# EasyEDA Pro project PAW3-NOMAG_Cheesecake-Blueberry-LSM6DSV_JST2.epro

# Schematic LSM6DSV_NOMAG_Rv_1
Board Name: LSM6DSV_NOMAG_JST2; Create Date: 2026-05-18; Page Name: LSM6; Project Name: NOMAG_Cheesecake-Blueberry-LSM6DSV_JST2; Schematic Name: LSM6DSV_NOMAG_Rv_1; Update Date: 2026-05-18; Company: Designed by SoraKage; Page Size: A4; Version: V2.3
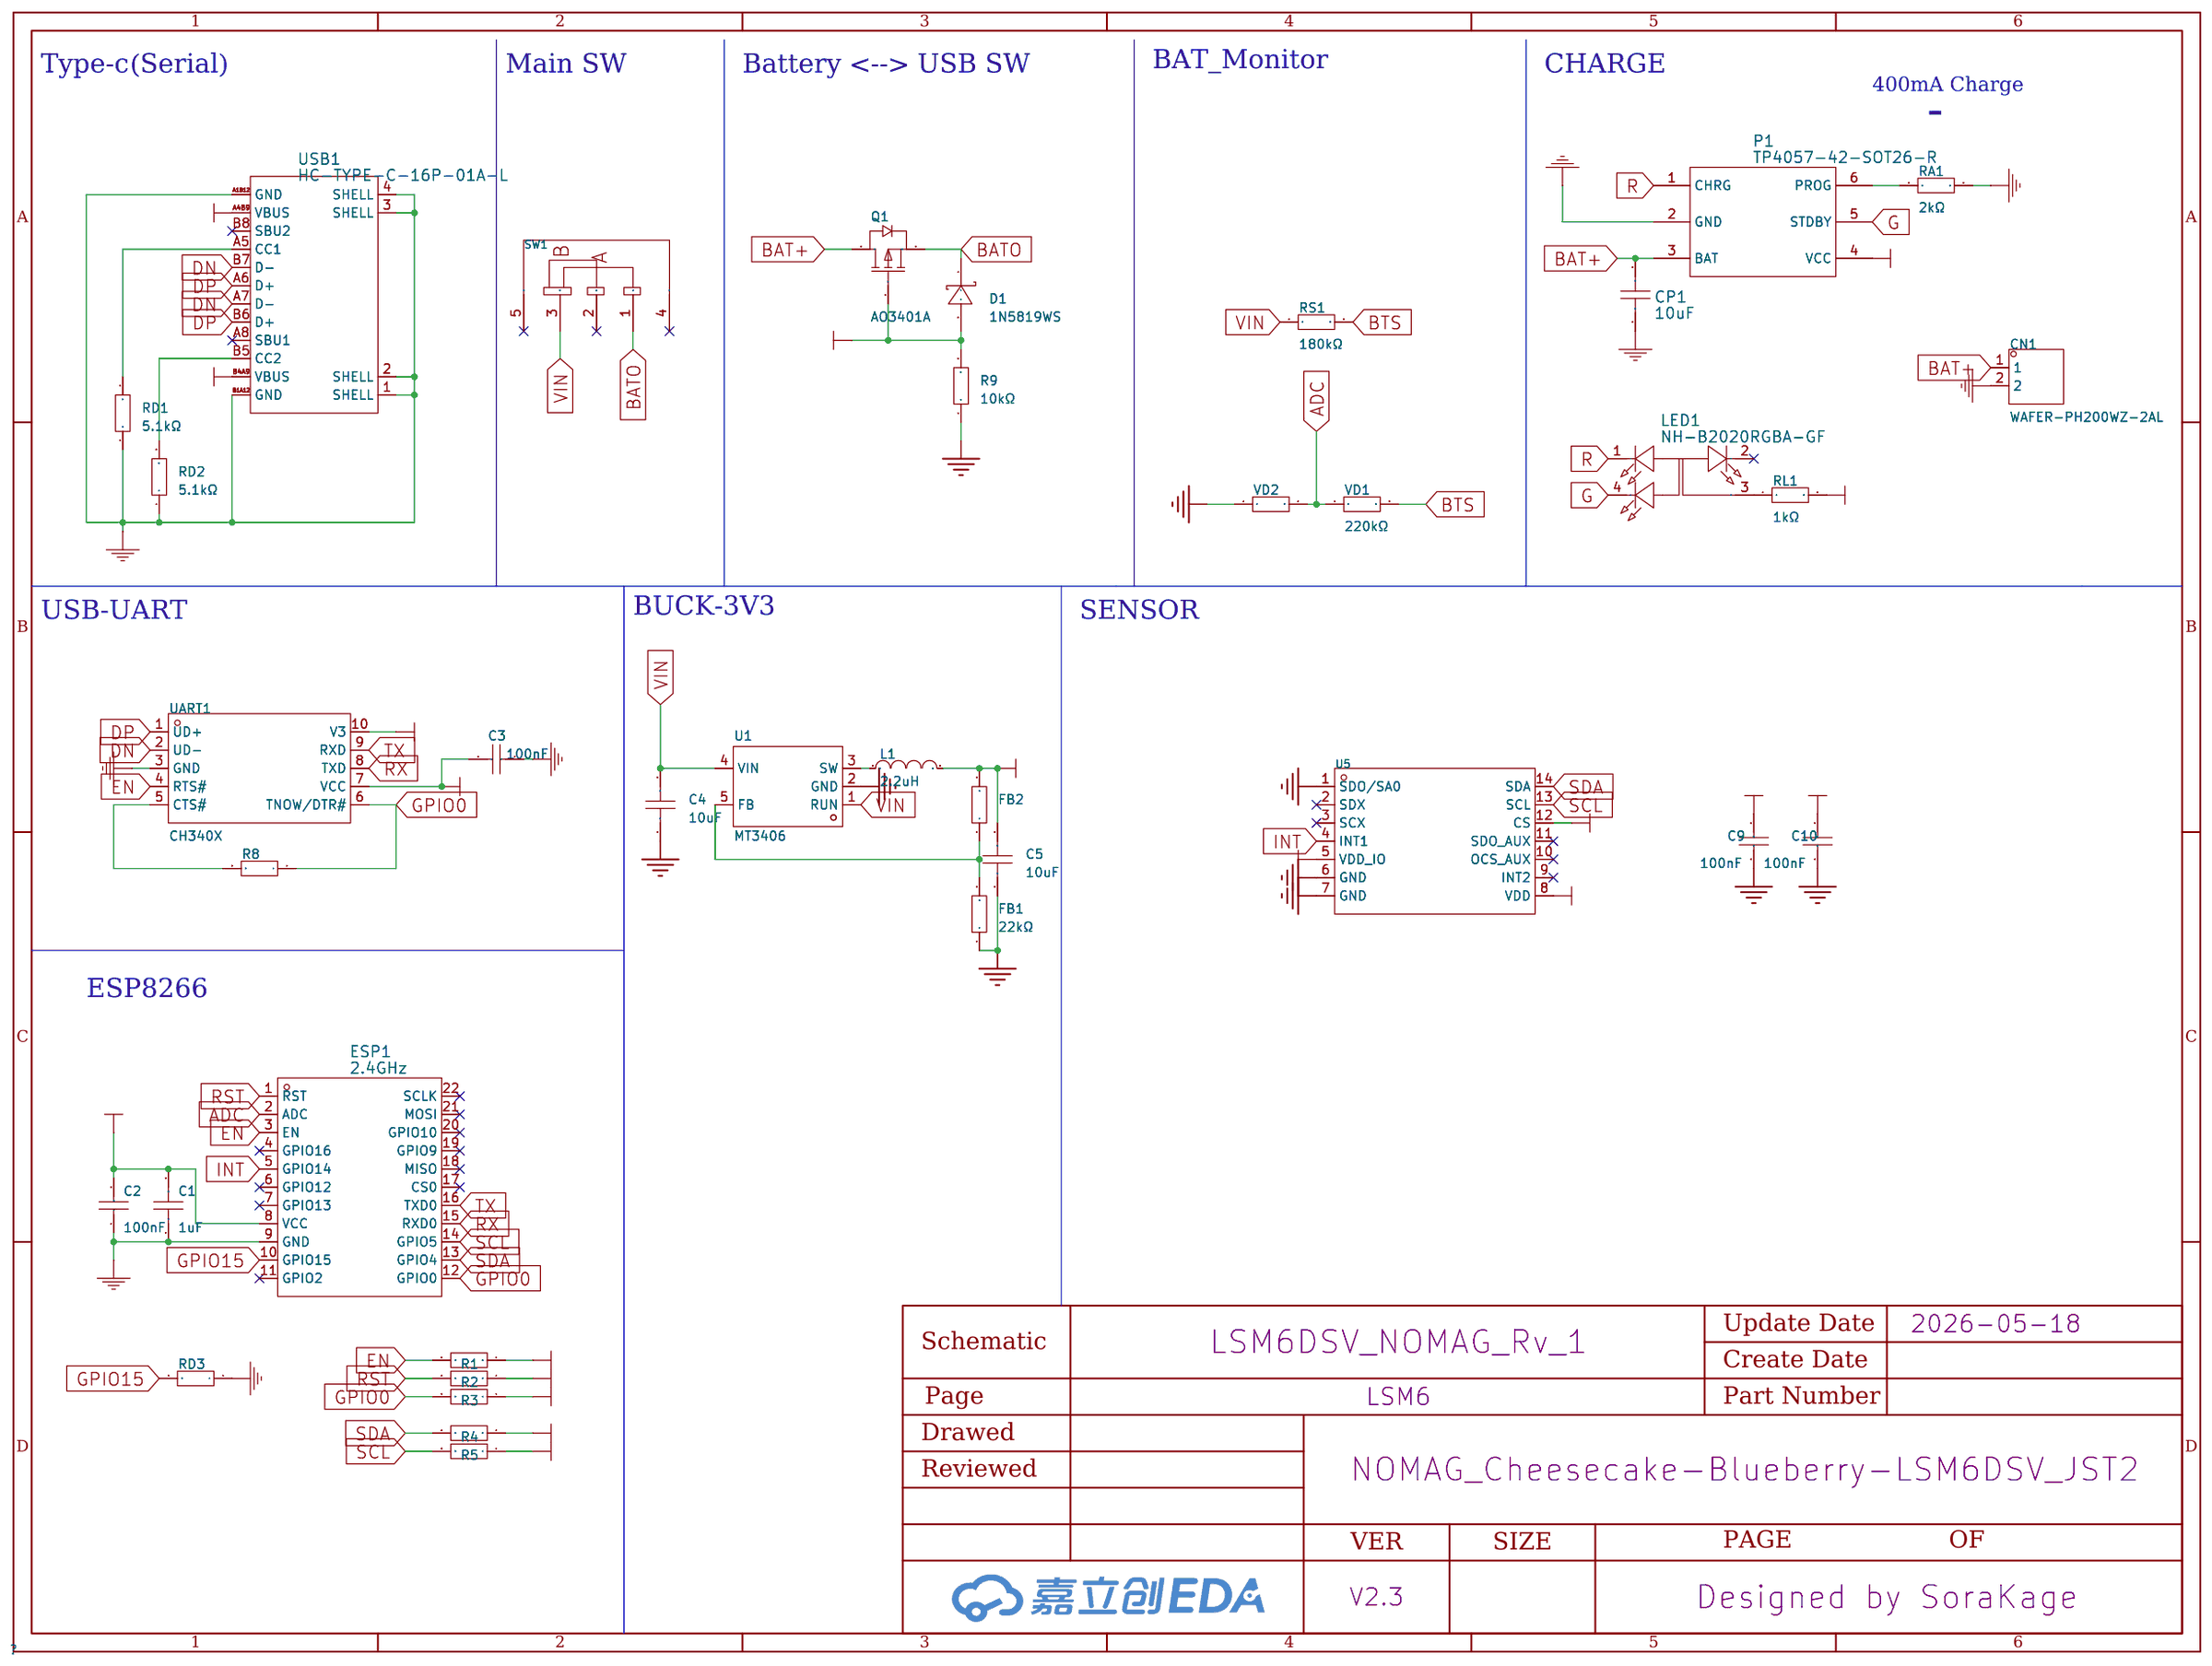
[diagram p0: schematic sheet]

## Parts
C1  1uF  [C0402]
C2  100nF  [C0402]
C3  100nF  [C0402]
C4  10uF  [C0603]
C5  10uF  [C0603]
C9  100nF  [C0402]
C10  100nF  [C0402]
CN1  WAFER-PH200WZ-2AL  [CONN-TH_2P-P2.00_WAFER-PH200WZ-Z102A]
CP1  10uF  [C0603]
D1  1N5819WS  [SOD-323_L1.8-W1.3-LS2.5-RD]
ESP1  2.4GHz  [WIFIM-SMD_ESP-12F-ESP8266MOD]
FB1  22kΩ  [R0402]
FB2  100kΩ  [R0402]
L1  2.2uH  [IND-SMD_L2.5-W2.0_YXMBL252010P]
LED1  NH-B2020RGBA-GF  [LED-ARRAY-SMD_4P-L2.1-W2.1-TL_NH-B2020RGBA]
P1  TP4057-42-SOT26-R  [SOT-23-6_L2.9-W1.6-P0.95-LS2.8-BL]
Q1  AO3401A  [SOT-23_L2.9-W1.3-P1.90-LS2.4-BR]
R1  4.7kΩ  [R0402]
R2  4.7kΩ  [R0402]
R3  4.7kΩ  [R0402]
R4  4.7kΩ  [R0402]
R5  4.7kΩ  [R0402]
R8  4.7kΩ  [R0402]
R9  10kΩ  [R0402]
RA1  2kΩ  [R0402]
RD1  5.1kΩ  [R0402]
RD2  5.1kΩ  [R0402]
RD3  4.7kΩ  [R0402]
RL1  1kΩ  [R0402]
RS1  180kΩ  [R0402]
SW1  K3-1270S-F2  [SW-TH_K3-1270S-F2]
U1  MT3406  [SOT-23-5_L3.0-W1.7-P0.95-LS2.8-BR]
U5  LSM6DSVQTR  [LGA-14_L3.0-W2.5-P0.50-TL]
UART1  CH340X  [MSOP-10_L3.0-W3.0-P0.50-LS5.0-BL]
USB1  HC-TYPE-C-16P-01A-L  [USB-C-SMD_G-SWITCH_GT-USB-7010EN]
VD1  220kΩ  [R0402]
VD2  100kΩ  [R0402]

## Library data of the parts
C1 = CL05A105KA5NQNC: 容值:1uF;精度:±10%;额定电压:25V;材质(温度系数):X5R;; LCSC Part Name: 1uF ±10% 25V; Supplier Part: C52923; Manufacturer: SAMSUNG(三星); Supplier Footprint: 0402; JLCPCB Part Class: 基础库; Datasheet: https://atta.szlcsc.com/upload/public/pdf/source/20160103/1457707735223.pdf; Supplier: LCSC; Tolerance: ±10%; Voltage Rated: 25V; Temperature Coefficient: X5R
C2 C3 C9 C10 = CL05B104KO5NNNC: 容值:100nF;精度:±10%;额定电压:16V;材质(温度系数):X7R;; LCSC Part Name: 100nF ±10% 16V; Supplier Part: C1525; Manufacturer: SAMSUNG(三星); Supplier Footprint: 0402; JLCPCB Part Class: Basic Part; Datasheet: https://atta.szlcsc.com/upload/public/pdf/source/20160103/1457707674891.pdf; Supplier: LCSC; Tolerance: ±10%; Voltage Rated: 16V; Temperature Coefficient: X7R
C4 C5 = CL10A106KP8NNNC: 容值:10uF;精度:±10%;额定电压:10V;材质(温度系数):X5R;; LCSC Part Name: 10uF ±10% 10V; Supplier Part: C19702; Manufacturer: SAMSUNG(三星); Supplier Footprint: 0603; JLCPCB Part Class: 基础库; Datasheet: https://atta.szlcsc.com/upload/public/pdf/source/20160103/1457707703378.pdf; Supplier: LCSC; Tolerance: ±10%; Voltage Rated: 10V; Temperature Coefficient: X5R
CN1 = WAFER-PH200WZ-2AL: Pins Structure:1x2P Pitch:2mm Mounting Type:Right Angle Reference Series:PH Number of Pins:2P Number of Rows:1 Number of PINs Per Row:2 Current Rating:2A Operating Temperature:-25℃~+85℃ Operating Temperature:-25℃~+85℃ Voltage Rating:250V Color:Blue Z-Heig; LCSC Part Name: 1x2P 间距:2mm 弯插 系列:PH; Supplier Part: C22751743; Manufacturer: HANBO(汉博); Supplier Footprint: 弯插,P=2mm; JLCPCB Part Class: Extended Part; Datasheet: https://item.szlcsc.com/datasheet/WAFER-PH200WZ-2AL/24478703.html; Supplier: LCSC; Pins Structure: 1x2P; Pitch: 2mm; Mounting Type: Right Angle; Reference Series: PH; Number of Pins: 2P; Number of Rows: 1; Number of PINs Per Row: 2; Current Rating: 2A; Operating Temperature: -25℃~+85℃; Voltage Rating: 250V; Color: Blue; Z-Height of the Board: 6.1mm; X-Length of Bottom Edge on Board (Spacing Line): 6mm; Y-Width of Bottom Edge on Board: 4.8mm
CP1 = 10uF: link: https://item.szlcsc.com/362304.html; 3DModel: C0603_L1.6-W0.8-H0.8; Supplier: LCSC; Manufacturer: SAMSUNG(三星); Manufacturer Part: CL10A106KP8NNNC; Supplier Part: C19702; JLCPCB Part Class: Basic Part
D1 = 1N5819WS_C191023: 直流反向耐压(Vr):40V;平均整流电流(Io):1A;正向压降(Vf):600mV@1A;; LCSC Part Name: 40V 1A 600mV@1A; Supplier Part: C191023; Manufacturer: Hottech(合科泰); Supplier Footprint: SOD-323; JLCPCB Part Class: 基础库; Datasheet: https://atta.szlcsc.com/upload/public/pdf/source/20220428/3CB86FD8D28D653594B4E35F9D5AEFD9.pdf; Supplier: LCSC; Reverse Voltage (Vr): 40V; Average Rectified Current (Io): 1A; Forward Voltage (Vf@If): 600mV@1A
ESP1 = ESP-12F(ESP8266MOD): 核心处理器:ESP8266芯片;频率:2.4GHz;天线形式:板载PCB天线;发射功率:16dBm;接收灵敏度:-90dBm;; LCSC Part Name: 完整的802.11b/g/nWi-FiSoC模块; Supplier Part: C82891; Manufacturer: Ai-Thinker(安信可); Supplier Footprint: SMD,16x24mm; JLCPCB Part Class: Extended Part; Datasheet: https://atta.szlcsc.com/upload/public/pdf/source/20210219/C82891_ABD84A460F4F056A2757267CCCA4B508.pdf; Supplier: LCSC; Output Power: 16dBm; Core Processor: ESP8266芯片; Support Interface: GPIO；UART；I2C；PWM；SPI；ADC; Antenna Type: 板载PCB天线; Operating Voltage: 3.3V; Receive  Current: 120mA; Send  Current: 170mA; Sensitivity: -90dBm; Operating Temperature: -40℃~+85℃
FB1 = 0402WGF2202TCE: 电阻类型:厚膜电阻;阻值:22kΩ;精度:±1%;功率:62.5mW;; LCSC Part Name: 22kΩ ±1% 62.5mW; Supplier Part: C25768; Manufacturer: UNI-ROYAL(厚声); Supplier Footprint: 0402; JLCPCB Part Class: 基础库; Datasheet: https://atta.szlcsc.com/upload/public/pdf/source/20200306/C422600_1E6D84923E4A46A82E41ADD87F860B5C.pdf; Supplier: LCSC; Type: 厚膜电阻; Tolerance: ±1%; Power(Watts): 62.5mW; Temperature Coefficient: ±100ppm/℃; Overload Voltage (Max): 50V; Operating Temperature Range: -55℃~+155℃
FB2 VD2 = 0402WGF1003TCE: Type:Thick Film Resistor Resistance:100kΩ Tolerance:±1% Tolerance:±1% Power(Watts):62.5mW Voltage-Supply(Max):50V Temperature Coefficient:±100ppm/℃ Temperature Coefficient:±100ppm/℃ Operating Temperature:-55℃~+155℃ Operating Temperature:-55℃~+155℃; LCSC Part Name: 100kΩ ±1% 62.5mW 厚膜电阻; Supplier Part: C25741; Manufacturer: UNI-ROYAL(厚声); Supplier Footprint: 0402; JLCPCB Part Class: Basic Part; Datasheet: https://item.szlcsc.com/datasheet/0402WGF1003TCE/26484.html; Supplier: LCSC; Type: Thick Film Resistor; Tolerance: ±1%; Power(Watts): 62.5mW; Voltage-Supply(Max): 50V; Temperature Coefficient: ±100ppm/℃; Operating Temperature: -55℃~+155℃
L1 = APH252010T2R2M: 类型:一体成型电感;电感值:2.2uH;精度:±20%;额定电流:2.1A;饱和电流(Isat):3A;; LCSC Part Name: 2.2uH ±20% 3A; Supplier Part: C5349606; Manufacturer: APV(爱普微); Supplier Footprint: L252010; JLCPCB Part Class: 扩展库; Datasheet: https://atta.szlcsc.com/upload/public/pdf/source/20230112/CD71A991BF44148C80048C09E1A9BC6B.pdf; Supplier: LCSC; Type: 一体成型电感; Tolerance: ±20%; Rated Current: 2.1A; Saturation Current (Isat): 3A; DC Resistance (DCR): 70mΩ
LED1 = NH-B2020RGBA-GF: Supplier Part: C52212030; Manufacturer: 国星光电; Supplier Footprint: SMD-4P,2.1x2.1mm; JLCPCB Part Class: Extended Part; Datasheet: https://item.szlcsc.com/datasheet/NH-B2020RGBA-GF/55063765.html; Supplier: LCSC
P1 = TP4057-42-SOT26-R: LCSC Part Name: TP4057 1%; Supplier Part: C12044; Manufacturer: TOPPOWER(南京拓微); Supplier Footprint: SOT-23-6; JLCPCB Part Class: Extended Part; Datasheet: https://atta.szlcsc.com/upload/public/pdf/source/20140228/1457706997013.pdf; Supplier: LCSC
Q1 = AO3401A_C15127: 类型:P沟道;漏源电压(Vdss):30V;连续漏极电流(Id):4A;功率(Pd):1.4W;导通电阻(RDS(on)@Vgs,Id):44mΩ@10V,4.3A;; LCSC Part Name: P沟道 30V 4A; Supplier Part: C15127; Manufacturer: AOS; Supplier Footprint: SOT-23-3L; JLCPCB Part Class: 基础库; Datasheet: https://atta.szlcsc.com/upload/public/pdf/source/20160507/1462613609053.pdf; Supplier: LCSC; Type: P沟道; Drain Source Voltage (Vdss): 30V; Continuous Drain Current (Id): 4A; Power Dissipation (Pd): 1.4W; Drain Source On Resistance (RDS(on)@Vgs,Id): 44mΩ@10V,4.3A; Gate Threshold Voltage (Vgs(th)@Id): 1.3V@250uA
R1-R5 R8 RD3 = 0402WGF4701TCE: Type:Thick Film Resistor Resistance:4.7kΩ Tolerance:±1% Tolerance:±1% Power(Watts):62.5mW Voltage-Supply(Max):50V Temperature Coefficient:±100ppm/℃ Temperature Coefficient:±100ppm/℃ Operating Temperature:-55℃~+155℃ Operating Temperature:-55℃~+155℃; LCSC Part Name: 4.7kΩ ±1% 62.5mW 厚膜电阻; Supplier Part: C25900; Manufacturer: UNI-ROYAL(厚声); Supplier Footprint: 0402; JLCPCB Part Class: Basic Part; Datasheet: https://item.szlcsc.com/datasheet/0402WGF4701TCE/26643.html; Supplier: LCSC; Type: Thick Film Resistor; Tolerance: ±1%; Power(Watts): 62.5mW; Voltage-Supply(Max): 50V; Temperature Coefficient: ±100ppm/℃; Operating Temperature: -55℃~+155℃
R9 = 0402WGF1002TCE: 电阻类型:厚膜电阻;阻值:10kΩ;精度:±1%;功率:62.5mW;; LCSC Part Name: 10kΩ ±1% 62.5mW; Supplier Part: C25744; Manufacturer: UNI-ROYAL(厚声); Supplier Footprint: 0402; JLCPCB Part Class: 基础库; Datasheet: https://atta.szlcsc.com/upload/public/pdf/source/20200306/C422600_1E6D84923E4A46A82E41ADD87F860B5C.pdf; Supplier: LCSC; Type: 厚膜电阻; Tolerance: ±1%; Power(Watts): 62.5mW; Temperature Coefficient: ±100ppm/℃; Overload Voltage (Max): 50V; Operating Temperature Range: -55℃~+155℃
RA1 = 0402WGF2001TCE: 电阻类型:厚膜电阻;阻值:2kΩ;精度:±1%;功率:62.5mW;; LCSC Part Name: 2kΩ ±1% 62.5mW; Supplier Part: C4109; Manufacturer: UNI-ROYAL(厚声); Supplier Footprint: 0402; JLCPCB Part Class: 基础库; Datasheet: https://atta.szlcsc.com/upload/public/pdf/source/20200306/C422600_1E6D84923E4A46A82E41ADD87F860B5C.pdf; Supplier: LCSC; Type: 厚膜电阻; Tolerance: ±1%; Power(Watts): 62.5mW; Temperature Coefficient: ±100ppm/℃; Overload Voltage (Max): 50V; Operating Temperature Range: -55℃~+155℃
RD1 RD2 = 0402WGF5101TCE: 电阻类型:厚膜电阻;阻值:5.1kΩ;精度:±1%;功率:62.5mW;; LCSC Part Name: 5.1kΩ ±1% 62.5mW; Supplier Part: C25905; Manufacturer: UNI-ROYAL(厚声); Supplier Footprint: 0402; JLCPCB Part Class: 基础库; Datasheet: https://atta.szlcsc.com/upload/public/pdf/source/20200306/C422600_1E6D84923E4A46A82E41ADD87F860B5C.pdf; Supplier: LCSC; Type: 厚膜电阻; Tolerance: ±1%; Power(Watts): 62.5mW; Temperature Coefficient: ±100ppm/℃; Overload Voltage (Max): 50V; Operating Temperature Range: -55℃~+155℃
RL1 = 0402WGF1001TCE: 电阻类型:厚膜电阻;阻值:1kΩ;精度:±1%;功率:62.5mW;; LCSC Part Name: 1kΩ ±1% 62.5mW; Supplier Part: C11702; Manufacturer: UNI-ROYAL(厚声); Supplier Footprint: 0402; JLCPCB Part Class: 基础库; Datasheet: https://atta.szlcsc.com/upload/public/pdf/source/20200306/C422600_1E6D84923E4A46A82E41ADD87F860B5C.pdf; Supplier: LCSC; Type: 厚膜电阻; Tolerance: ±1%; Power(Watts): 62.5mW; Temperature Coefficient: ±100ppm/℃; Overload Voltage (Max): 50V; Operating Temperature Range: -55℃~+155℃
RS1 = 0402WGF1803TCE: 阻值:180kΩ;精度:±1%;功率:62.5mW;温度系数:±100ppm/℃;电阻类型:厚膜电阻;; LCSC Part Name: 180kΩ ±1% 62.5mW 厚膜电阻; Supplier Part: C25760; Manufacturer: UNI-ROYAL(厚声); Supplier Footprint: 0402; JLCPCB Part Class: 扩展库; Datasheet: https://atta.szlcsc.com/upload/public/pdf/source/20200306/C422600_1E6D84923E4A46A82E41ADD87F860B5C.pdf; Supplier: LCSC; Tolerance: ±1%; Power(Watts): 62.5mW; Overload Voltage (Max): 50V; Temperature Coefficient: ±100ppm/℃; Type: 厚膜电阻; Operating Temperature Range: -55℃~+155℃
SW1 = K3-1270S-F2: Circuit:SPDT Actuator Style:Rectangular Columnar Termination Style:SMD(SMT) Tab Length:8.8mm Width:2mm Switch Height:2mm Mounting Type:Surface Mount, Right Angle Actuator Color:Black Current Rating:300mA Voltage Rating:6V Life:10,000 Cycles Operating Temp; LCSC Part Name: 卧贴双档 滑动开关; Supplier Part: C145857; Manufacturer: 韩国韩荣; Supplier Footprint: SMD,8.8x2mm; JLCPCB Part Class: Extended Part; Datasheet: https://item.szlcsc.com/datasheet/K3-1270S-F2/157189.html; Supplier: LCSC; Circuit: SPDT; Actuator Style: Rectangular Columnar; Termination Style: SMD(SMT) Tab; Length: 8.8mm; Width: 2mm; Switch Height: 2mm; Mounting Type: Surface Mount, Right Angle; Actuator Color: Black; Current Rating: 300mA; Voltage Rating: 6V; Life: 10,000 Cycles; Operating Temperature: -25℃~+80℃
U1 = MT3406: Function:Buck Voltage - Supply:2V~6V Voltage - Supply:2V~6V Output Voltage:600mV~6V Output Voltage:600mV~6V Output Current:1A Frequency - Switching:1.5MHz Frequency - Switching:1.5MHz Operating Temperature:-40℃~+85℃@(TA) Operating Temperature:-40℃~+85℃@(T; LCSC Part Name: 1A，2V-6V输入，1.5MHz同步降压转换器; Supplier Part: C22462728; Manufacturer: 西安航天民芯; Supplier Footprint: SOT-23-5; JLCPCB Part Class: Extended Part; Datasheet: https://item.szlcsc.com/datasheet/MT3406/24149576.html; Supplier: LCSC; Function: Buck; Voltage - Supply: 2V~6V; Output Voltage: 600mV~6V; Output Current: 1A; Frequency - Switching: 1.5MHz; Operating Temperature: -40℃~+85℃@(TA); Synchronous Rectifier: Yes; Number of Outputs: 1; Topology: Buck; Quiescent Current: 10uA; Switch tube (built-in/external): Built-in; Output Type: Adjustable
U5 = LSM6DSVQTR: Supplier Part: C17496470; Manufacturer: ST(意法半导体); JLCPCB Part Class: Extended Part; Supplier: LCSC
UART1 = CH340X: Supplier Part: C3035748; Manufacturer: WCH(南京沁恒); Supplier Footprint: MSOP-10; JLCPCB Part Class: Extended Part; Supplier: LCSC
USB1 = HC-TYPE-C-16P-01A-L: Connector Type:Type-C Protocol Standard:USB 3.1 Gender:Female Mounting Type:Surface Mount, Right Angle Number of Contacts:16P Number of Ports:1 Current Rating-Power:3A Connect-Disconnect Life:10,000 cycles Detection color:Blue Operating Temperature:-25℃~+; LCSC Part Name: Type-C 母 卧贴; Supplier Part: C2997432; Manufacturer: HCTL(华灿天禄); Supplier Footprint: SMD; JLCPCB Part Class: Extended Part; Datasheet: https://item.szlcsc.com/datasheet/HC-TYPE-C-16P-01A-L/3468395.html; Supplier: LCSC; Connector Type: Type-C; Protocol Standard: USB 3.1; Gender: Female; Mounting Type: Surface Mount, Right Angle; Number of Contacts: 16P; Number of Ports: 1; Current Rating-Power: 3A; Connect-Disconnect Life: 10,000 cycles; Detection color: Blue; Operating Temperature: -25℃~+85℃
VD1 = 0402WGF2203TCE: 电阻类型:厚膜电阻;阻值:220kΩ;精度:±1%;功率:62.5mW;; LCSC Part Name: 220kΩ ±1% 62.5mW; Supplier Part: C25767; Manufacturer: UNI-ROYAL(厚声); Supplier Footprint: 0402; JLCPCB Part Class: 基础库; Datasheet: https://atta.szlcsc.com/upload/public/pdf/source/20200306/C422600_1E6D84923E4A46A82E41ADD87F860B5C.pdf; Supplier: LCSC; Type: 厚膜电阻; Tolerance: ±1%; Power(Watts): 62.5mW; Temperature Coefficient: ±100ppm/℃; Overload Voltage (Max): 50V; Operating Temperature Range: -55℃~+155℃

## Nets
3V3: C1.2 C2.2 C3.2 C5.2 C9.1 C10.1 ESP1.8(VCC) FB2.2 L1.2 R1.1 R2.1 R3.1 R4.1 R5.1 U5.5(VDD_IO) U5.8(VDD) U5.12(CS) UART1.7(VCC) UART1.10(V3)
+5V: D1.2(A) P1.4(VCC) Q1.1(G) R9.2 RL1.2 USB1.A4B9(VBUS) USB1.B4A9(VBUS)
GND: C1.1 C2.1 C3.1 C4.1 C5.1 C9.2 C10.2 CN1.2 CP1.1 ESP1.9(GND) FB1.1 P1.2(GND) R9.1 RA1.2 RD1.1 RD2.1 RD3.1 U1.2(GND) U5.1(SDO/SA0) U5.6(GND) U5.7(GND) UART1.3(GND) USB1.1(SHELL) USB1.2(SHELL) USB1.3(SHELL) USB1.4(SHELL) USB1.A1B12(GND) USB1.B1A12(GND) VD2.1
VIN: C4.2 RS1.1 SW1.3 U1.1(RUN) U1.4(VIN)
ADC: ESP1.2(ADC) VD1.1 VD2.2
BAT+: CN1.1 CP1.2 P1.3(BAT) Q1.3(D)
BATO: D1.1(K) Q1.2(S) SW1.1
BTS: RS1.2 VD1.2
DN: UART1.2(UD-) USB1.A7(D-) USB1.B7(D-)
DP: UART1.1(UD+) USB1.A6(D+) USB1.B6(D+)
EN: ESP1.3(EN) R1.2 UART1.4(RTS#)
G: LED1.4(-) P1.5(STDBY)
GPIO0: ESP1.12(GPIO0) R3.2 R8.1 UART1.6(TNOW/DTR#)
GPIO15: ESP1.10(GPIO15) RD3.2
INT: ESP1.5(GPIO14) U5.4(INT1)
R: LED1.1(-) P1.1(CHRG)
RST: ESP1.1(RST) R2.2
RX: ESP1.15(RXD0) UART1.8(TXD)
SCL: ESP1.14(GPIO5) R5.2 U5.13(SCL)
SDA: ESP1.13(GPIO4) R4.2 U5.14(SDA)
TX: ESP1.16(TXD0) UART1.9(RXD)
$1N2030: RD1.2 USB1.A5(CC1)
$1N2031: RD2.2 USB1.B5(CC2)
$1N2038: P1.6(PROG) RA1.1
$1N5947: L1.1 U1.3(SW)
$1N5953: FB1.2 FB2.1 U1.5(FB)
$1N6173: R8.2 UART1.5(CTS#)
$1N9979: LED1.3(+) RL1.1

Not connected (* = marked no-connect by the designer): ESP1 4(GPIO16)* 6(GPIO12)* 7(GPIO13)* 11(GPIO2)* 17(CS0)* 18(MISO)* 19(GPIO9)* 20(GPIO10)* 21(MOSI)* 22(SCLK)*; LED1 2(-)*; SW1 2* 4* 5*; U5 2(SDX)* 3(SCX)* 9(INT2)* 10(OCS_AUX)* 11(SDO_AUX)*; USB1 A8(SBU1)* B8(SBU2)*

## Notes on the sheet
- Type-c(Serial)
- Main SW
- Battery <--> USB SW
- BAT_Monitor
- CHARGE
- 400mA Charge
- -
- BUCK-3V3
- USB-UART
- SENSOR
- ESP8266

# Board LSM6DSV_NOMAG_Rv_1
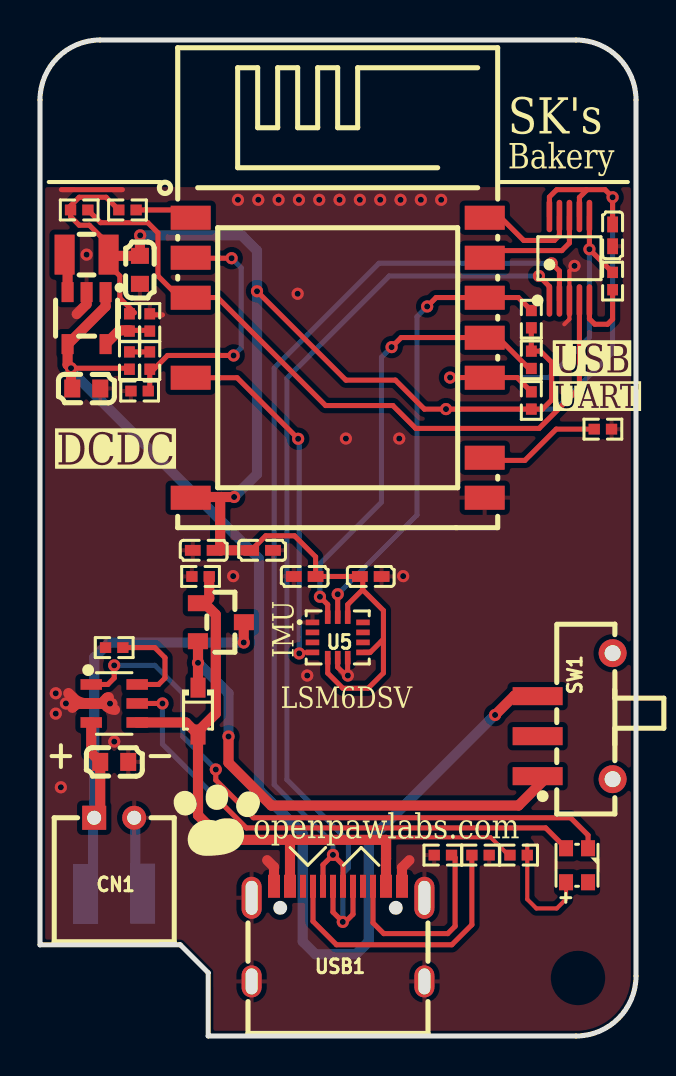
[diagram p1: board, top side]
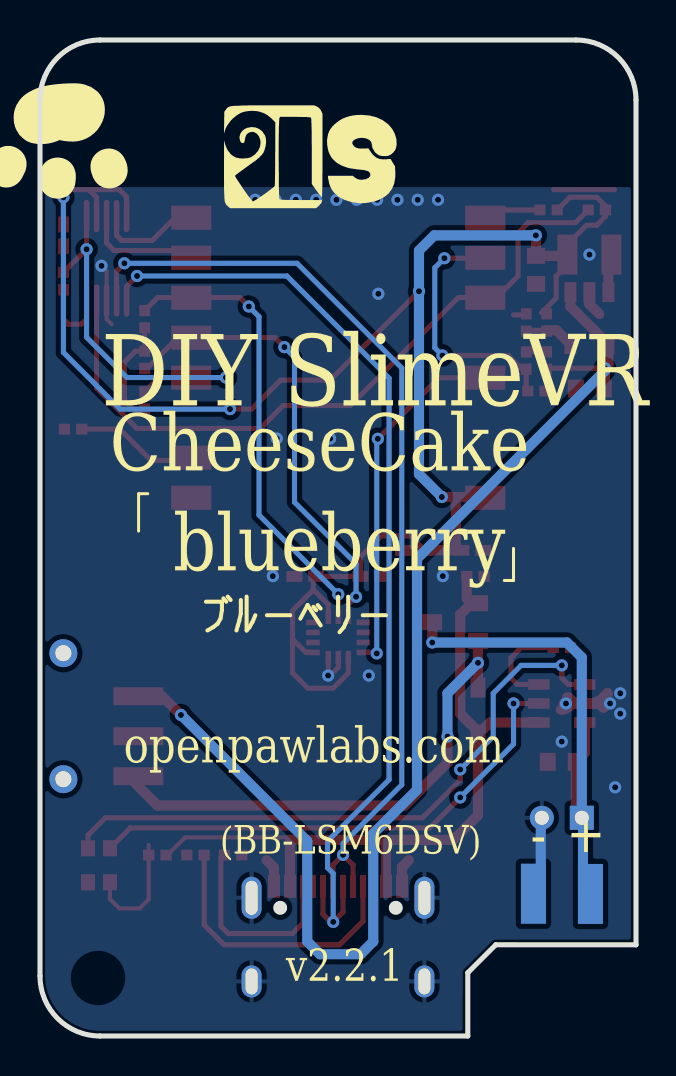
[diagram p2: board, bottom side, seen from below]

Outline 29.8 x 49.8 mm; copper layers: Top Layer, Bottom Layer. Coordinates in mm from the lower left corner of the outline.
Outline path: 0,4.56 0,46.8 arc(0.88,48.92) 3,49.8 26.8,49.8 arc(28.92,48.92) 29.8,46.8 29.8,3 arc(28.92,0.88) 26.8,0 8.41,0 8.41,3.16 7.01,4.56 0,4.56
Stack: Top Layer 0.035mm / Dielectric1 0.91mm FR4 er 4.5 / Bottom Layer 0.035mm

## Design rules (mm)
spacing Default (default): track to track 0.127, other pairs 0 to 0.127
track width Default (default): min 0.127, default 0.127, max 25.4
differential pair differentialPair (default): width min 0.127, default 0.254, max 2.54; gap min 0.152, default 0.152
via Default (default): diameter min 0.61, default 0.61, max 100.025; hole min 0.305, default 0.305, max 59.995
net GND uses gge20888(1)

## Placement (name value [footprint] x y rotation side)
C1  1uF  [C0402]  8.18 24.28 0 top
C2  100nF  [C0402]  11.1 24.28 180 top
C3  100nF  [C0402]  28.63 40.03 90 top
C4  10uF  [C0603]  2.31 32.37 180 top
C5  10uF  [C0603]  5 38.31 90 top
C9  100nF  [C0402]  16.54 22.98 0 top
C10  100nF  [C0402]  13.24 22.98 180 top
CN1  WAFER-PH200WZ-2AL  [CONN-TH_2P-P2.00_WAFER-PH200WZ-Z102A]  3.71 10.91 0 top
CP1  10uF  [C0603]  3.71 13.71 180 top
D1  1N5819WS  [SOD-323_L1.8-W1.3-LS2.5-RD]  7.9 16.25 270 top
ESP1  2.4GHz  [wifim-smd_esp-12f-esp8266mod]  14.89 33.26 270 top
FB1  22kΩ  [R0402]  5.49 35.68 270 top
FB2  100kΩ  [R0402]  4.47 35.68 90 top
L1  2.2uH  [IND-SMD_L2.5-W2.0_YXMBL252010P]  2.33 39.07 180 top
LED1  NH-B2020RGBA-GF  [LED-ARRAY-SMD_4P-L2.1-W2.1-TL_NH-B2020RGBA]  26.85 8.54 270 top
NOREF  -  [Pad_e268]  5.13 7.11 0 top
NOREF#2  -  [Pad_e264]  2.28 7.1 0 top
P1  TP4057-42-SOT26-R  [SOT-23-6_L2.9-W1.6-P0.95-LS2.8-BL]  3.71 16.63 270 top
Q1  AO3401A  [SOT-23_L2.9-W1.3-P1.90-LS2.4-BR]  9.04 20.69 180 top
R1  4.7kΩ  [R0402]  1.96 41.3 0 top
R2  4.7kΩ  [R0402]  4.37 41.3 0 top
R3  4.7kΩ  [R0402]  24.57 31.78 90 top
R4  4.7kΩ  [R0402]  24.57 33.81 270 top
R5  4.7kΩ  [R0402]  24.57 35.84 90 top
R8  4.7kΩ  [R0402]  28.63 37.75 270 top
R9  10kΩ  [R0402]  8.03 22.98 0 top
RA1  2kΩ  [R0402]  3.71 19.42 180 top
RD1  5.1kΩ  [R0402]  22.03 9.04 180 top
RD2  5.1kΩ  [R0402]  20.14 9.04 0 top
RD3  4.7kΩ  [R0402]  28.15 30.34 180 top
RL1  1kΩ  [R0402]  23.93 9.04 180 top
RS1  180kΩ  [R0402]  4.47 33.77 90 top
SW1  K3-1270S-F2  [SW-TH_K3-1270S-F2]  27.02 15.99 0 top
U1  MT3406  [SOT-23-5_L3.0-W1.7-P0.95-LS2.8-BR]  2.33 35.89 90 top
U5  LSM6DSVQTR  [LGA-14_L3.0-W2.5-P0.50-TL]  14.89 19.93 0 top
UART1  CH340X  [MSOP-10_L3.0-W3.0-P0.50-LS5.0-BL]  26.47 38.89 0 top
USB1  HC-TYPE-C-16P-01A-L  [USB-C-SMD_G-SWITCH_GT-USB-7010EN]  14.9 5.11 0 top
VD1  220kΩ  [R0402]  5.49 33.77 90 top
VD2  100kΩ  [R0402]  4.98 32.25 0 top

## Footprints (pads in the part's own frame, mm; a bottom-side part is the same pattern mirrored in y, then rotated)
C0402
  rect 0.79x0.54 smd: 1(-0.545,0) 2(0.545,0)
C0603
  rect 0.8x0.9 smd: 1(-0.7,0) 2(0.7,0)
CONN-TH_2P-P2.00_WAFER-PH200WZ-Z102A
  rect 1.2x1.2 hole 0.7: 1(-1,0)
  round 1.2 hole 0.7: 2(1,0)
IND-SMD_L2.5-W2.0_YXMBL252010P
  rect 1x2 smd: 1(1.1,0) 2(-1.1,0)
LED-ARRAY-SMD_4P-L2.1-W2.1-TL_NH-B2020RGBA
  rect 0.8x0.7 smd: 1(-0.85,0.55) 2(0.85,0.55) 3(0.85,-0.55) 4(-0.85,-0.55)
LGA-14_L3.0-W2.5-P0.50-TL
  rect 0.675x0.28 smd: 1(-1.262,0.75) 2(-1.262,0.25) 3(-1.262,-0.25) 4(-1.262,-0.75) 8(1.262,-0.75) 9(1.262,-0.25) 10(1.262,0.25) 11(1.262,0.75)
  rect 0.28x0.675 smd: 5(-0.5,-1.012) 6(0,-1.012) 7(0.5,-1.012) 12(0.5,1.012) 13(0,1.012) 14(-0.5,1.012)
MSOP-10_L3.0-W3.0-P0.50-LS5.0-BL
  oval 0.28x1.62 smd: 1(-1,-2.11) 2(-0.5,-2.11) 3(0,-2.11) 4(0.5,-2.11) 5(1,-2.11) 6(1,2.11) 7(0.5,2.11) 8(0,2.11) 9(-0.5,2.11) 10(-1,2.11)
Pad_e264
  rect 1.25x3 smd far side: 1(0,0)
Pad_e268
  rect 1.25x3 smd far side: 2(0,0)
R0402
  rect 0.566x0.54 smd: 1(-0.433,0) 2(0.433,0)
SOD-323_L1.8-W1.3-LS2.5-RD
  rect 1x0.75 smd: 1(-1.173,0) 2(1.173,0)
SOT-23-5_L3.0-W1.7-P0.95-LS2.8-BR
  rect 1x0.6 smd: 1(1.3,-0.95) 2(1.3,0) 3(1.3,0.95) 4(-1.3,0.95) 5(-1.3,-0.95)
SOT-23-6_L2.9-W1.6-P0.95-LS2.8-BL
  rect 0.532x1.072 smd: 1(-0.95,-1.149) 2(0,-1.149) 3(0.95,-1.149) 4(0.95,1.149) 5(0,1.149) 6(-0.95,1.149)
SOT-23_L2.9-W1.3-P1.90-LS2.4-BR
  rect 1x0.8 smd: 1(1.15,-0.95) 2(1.15,0.95) 3(-1.15,0)
SW-TH_K3-1270S-F2
  rect 2.5x0.9 smd: 1(-2.137,-3.001) 2(-2.137,-1) 3(-2.137,1)
  round 1.4 hole 0.8: 4(1.613,-3.15) 5(1.613,3.15)
USB-C-SMD_G-SWITCH_GT-USB-7010EN
  oval 1x2.1 hole 0.6x1.7: 1(-4.32,1.802) 2(4.32,1.802)
  oval 1x1.6 hole 0.6x1.3: 3(4.32,-2.377) 4(-4.32,-2.377)
  rect 0.6x1.15 smd: A1B12(-3.2,2.377) A4B9(-2.4,2.377) B1A12(3.2,2.377) B4A9(2.4,2.377)
  rect 0.3x1.15 smd: A5(-1.25,2.377) A6(-0.25,2.377) A7(0.25,2.377) A8(1.25,2.377) B5(1.75,2.377) B6(0.75,2.377) B7(-0.75,2.377) B8(-1.75,2.377)
wifim-smd_esp-12f-esp8266mod
  rect 1.2x2 smd: 1(-7.651,-7.351) 2(-5.651,-7.351) 3(-3.651,-7.351) 5(0.349,-7.351) 8(6.349,-7.351) 9(6.349,7.35) 10(4.349,7.35) 12(0.349,7.351) 13(-1.651,7.35) 14(-3.651,7.351) 15(-5.651,7.351) 16(-7.651,7.351)

## Nets
As in the schematic, except:
GND: C1.1 C2.1 C3.1 C4.1 C5.1 C9.2 C10.2 CN1.2 CP1.1 ESP1.9 FB1.1 NOREF.2 P1.2 R9.1 RA1.2 RD1.1 RD2.1 RD3.1 U1.2 U5.1 U5.6 U5.7 UART1.3 USB1.1 USB1.2 USB1.3 USB1.4 USB1.A1B12 USB1.B1A12 VD2.1
BAT+: CN1.1 CP1.2 NOREF#2.1 P1.3 Q1.3

Pads without a net: LED1 2; SW1 2 4 5; U5 9 10 11; USB1 A8 B8

## Via types
v1: diameter 0.61, hole 0.305, Top Layer to Bottom Layer, 54 vias

## Routing (per net, layer and track width the routed paths; a pad name or vN(x,y) marks a point on that pad's centre or on a via; arc(x,y) is an arc through that point)
3V3: length 103.5
  Top Layer w0.25: 17.17,18.15 16.41,17.39 15.14,17.39 14.39,18.14 14.39,18.87 14.4,18.88
  Top Layer w0.254: L1.2 3.43,39.58 2.47,40.54 1.96,40.54 1.53,40.97 1.53,41.5 1.96,41.94 3.31,41.94 R2.1 ; UART1.7 26.97,41.93 27.33,42.29 27.3,42.32 ; 17.17,19.84 17.17,21.27 16.13,22.31 ; 17.17,19.84 16.51,19.18 U5.8 ; 17.17,19.84 17.17,18.15 ; 27.3,42.32 25.84,42.32 25.47,41.95 UART1.10 ; 27.3,42.32 28.25,42.32 v1(28.63,41.94) C3.2 ; R5.1 R4.1 25.02,34.24 25.58,33.68 25.58,31.8 25.13,31.34 R3.1 v1(20.3,31.34) 19.22,31.34 17.77,32.79 15.3,32.79 v1(10.85,37.24) ; 3.49,39.01 3.49,38.5 3.99,38 3.99,36.89 4.73,36.16 ; 16.13,22.31 16.14,22.32 16.14,22.83 C9.1 C10.1 13.78,23.96 12.73,25.01 11.28,25.01 C2.2 ; 16.13,22.31 15.39,21.57 U5.12
  Top Layer w0.508: L1.2 3.49,39.01 C5.2 5,40.02 v1(5.01,40.03) ; 9.07,26.95 7.45,26.95 7.42,26.92 ; 9.07,26.95 v1(9.71,26.95) ; 9.07,26.95 9.01,26.89 9.01,24.28 10.4,24.28
  Bottom Layer w0.254: v1(20.3,31.34) 25.79,31.34 28.63,34.18 v1(28.63,41.94)
  Bottom Layer w0.508: v1(9.71,26.95) 10.85,28.09 v1(10.85,37.24) 10.85,39.27 10.09,40.03 v1(5.01,40.03)
+5V: length 38.5
  Top Layer w0.203: RL1.2 23.42,9.04 22.53,9.93 17.45,9.93 17.45,8.86 17.3,8.86
  Top Layer w0.508: D1.2 7.3,15.68 P1.4 ; D1.2 7.9,11.04 9.13,9.81 12.5,9.81 ; D1.2 7.9,15.23 8.79,16.12 8.79,21.07 8.22,21.64 ; 12.5,9.81 17.3,9.81 USB1.B4A9 ; 12.5,9.81 USB1.A4B9 ; 8.22,21.64 Q1.1 ; 8.22,21.64 8.46,21.88 R9.2
GND: length 21.5
  Top Layer w0.203: v1(26.73,38.51) 26.47,38.25 UART1.3 26.47,35.84 26.22,35.59
  Top Layer w0.25: 14.88,18.83 14.88,18.44 15.38,17.94 15.38,18.9
  Top Layer w0.254: 4.12,42.32 1.07,42.32 ; 5.61,36.06 6.12,36.06
  Top Layer w0.508: 11.36,8.79 11.7,8.45 USB1.A1B12 ; U1.2 2.33,36.59 1.83,36.09 ; 18.47,8.79 18.1,8.42 USB1.B1A12
  Top Layer w0.53: 1.42,17.13 1.65,16.91 arc(1.96,16.7) 2.33,16.63 ; 1.62,16.42 1.67,16.47 arc(1.84,16.59) 2.04,16.63 ; 1.54,16.63 3.61,16.63 ; 3.08,16.63 3.35,16.9 arc(3.39,16.92) 3.43,16.93 ; 3.21,16.63 3.36,16.47 arc(3.53,16.36) 3.74,16.32
  Bottom Layer w0.508: CN1.2 4.76,10.86 4.76,7.19
  vias: v1(0.79,17.13) v1(0.79,16.12) v1(1.04,12.44) v1(1.3,16.63) v1(2.33,39.07) v1(3.5,16.62) v1(3.71,14.72) v1(9.66,22.99) v1(9.9,41.81) v1(10.91,41.81) v1(11.93,41.81) v1(12.95,41.81) v1(12.88,37.11) v1(13.36,18.02) v1(13.96,41.81) v1(14.98,41.81) v1(15.3,29.87) v1(15.39,18.02) v1(15.99,41.81) v1(17.01,41.81) v1(18.03,41.81) v1(17.96,29.87) v1(18.16,22.99) v1(19.04,41.81) v1(20.06,41.81)
VIN: length 62.8
  Top Layer w0.254: v1(1.55,33.39) 4.42,33.39 RS1.1
  Top Layer w0.508: 1.61,32.5 1.55,32.56 v1(1.55,33.39) 1.38,33.56 U1.4 1.4,34.59 3.28,36.48 U1.1 ; 25.34,17 25.32,17.02 23.72,17.02 v1(22.75,16.05)
  Bottom Layer w0.508: v1(1.55,33.39) 1.55,33.26 10.95,23.87 10.95,12.31 13.14,10.12 13.14,4.73 13.77,4.09 15.8,4.09 16.44,4.73 16.44,9.75 22.74,16.05 v1(22.75,16.05)
ADC: length 13
  Top Layer w0.254: VD2.2 5.49,32.32 VD1.1 5.69,33.34 6.38,34.03 v1(9.68,34.03) ; 7.42,38.92 7.46,38.89 v1(9.58,38.89)
  Bottom Layer w0.254: v1(9.68,34.03) 10.06,34.41 10.06,38.41 v1(9.58,38.89)
BAT+: length 25.7
  Top Layer w0.508: P1.3 2.56,14.15 CP1.2 3.01,11.21 CN1.1 ; Q1.3 10.19,20.68 v1(10.19,19.67)
  Bottom Layer w0.5: 2.65,7.14 2.65,10.85 CN1.1
  Bottom Layer w0.508: CN1.1 2.71,18.93 3.46,19.67 v1(10.19,19.67)
BATO: length 25.2
  Top Layer w0.508: 25.34,12.97 25.34,12.94 23.93,11.52 11.56,11.52 9.43,13.66 v1(9.43,14.98) ; Q1.2 7.9,19.73 v1(7.9,18.66) 7.9,17.54
  Bottom Layer w0.508: v1(7.9,18.66) 9.43,17.13 v1(9.43,14.98)
BTS: length 1
  Top Layer w0.254: RS1.2 VD1.2
DN: length 47.2
  Top Layer w0.254: USB1.A7 15.15,8.55 v1(14.65,9.06) 14.15,8.56 USB1.B7 ; v1(25.58,38.63) 25.97,38.25 UART1.2
  Bottom Layer w0.254: v1(14.65,9.06) 14.65,9.63 11.71,12.56 11.71,33.4 16.95,38.63 v1(25.58,38.63)
DP: length 48.8
  Top Layer w0.254: USB1.B6 15.65,6.09 15.27,5.7 v1(15.14,5.7) 14.65,6.19 USB1.A6 ; UART1.1 25.47,37.48 v1(24.95,38)
  Bottom Layer w0.254: v1(15.14,5.7) 15.14,8.13 15.42,8.41 15.42,9.74 12.35,12.82 12.35,32.89 17.45,38 v1(24.95,38)
EN: length 35.6
  Top Layer w0.254: 2.39,41.3 3.03,40.67 5.39,40.67 5.9,40.16 5.9,38 6.98,36.92 8.88,36.92 14.28,31.52 17.64,31.52 18.79,30.38 24.96,30.38 26.97,32.39 UART1.4
G: length 25.6
  Top Layer w0.254: LED1.4 25.28,10.4 10.31,10.4 v1(8.79,11.93) ; P1.5 v1(6.12,16.63)
  Bottom Layer w0.254: v1(6.12,16.63) 6.12,14.59 v1(8.79,11.93)
GPIO0: length 19.9
  Top Layer w0.254: v1(20.5,32.92) 23.85,32.92 R3.2 ; R8.1 v1(27.47,39.34) UART1.6
  Bottom Layer w0.254: v1(27.47,39.34) 27.47,34.94 25.46,32.92 v1(20.5,32.92)
GPIO15: length 5.9
  Top Layer w0.254: 22.52,28.92 22.66,28.78 24.25,28.78 25.81,30.34 RD3.2
INT: length 18.1
  Top Layer w0.203: v1(12.96,19.13) 13.01,19.18 13.62,19.18 U5.4
  Top Layer w0.254: ESP1.5 9.85,32.91 v1(12.91,29.86)
  Bottom Layer w0.254: v1(12.91,29.86) 12.96,29.8 v1(12.96,19.13)
R: length 31.4
  Top Layer w0.254: LED1.1 27.4,10.04 26.53,10.91 10.68,10.91 8.79,12.8 v1(8.79,13.32) ; P1.1 3.39,17.58 3.71,17.9 v1(3.71,18.53)
  Bottom Layer w0.254: v1(3.71,18.53) 5.74,18.53 7.14,17.13 7.14,14.98 v1(8.79,13.32)
RST: length 2.8
  Top Layer w0.254: R2.2 7.04,41.3 7.42,40.92
RX: length 5.6
  Top Layer w0.254: UART1.8 26.47,39.65 26.09,39.27 22.87,39.27 22.52,38.92
SCL: length 23
  Top Layer w0.254: R5.2 23.92,36.92 19.81,36.92 v1(19.36,36.48) ; v1(14.89,22.09) U5.13
  Bottom Layer w0.254: v1(19.36,36.48) 18.85,35.97 18.85,26.05 v1(14.89,22.09)
SDA: length 23
  Top Layer w0.254: R4.2 24.45,33.38 22.9,34.92 18.06,34.92 v1(17.58,34.44) ; U5.14 14.39,21.57 v1(14,21.96)
  Bottom Layer w0.254: v1(14,21.96) 14,23.61 17.07,26.69 17.07,33.94 v1(17.58,34.44)
TX: length 5
  Top Layer w0.254: UART1.9 25.97,40.03 25.72,39.78 24.19,39.78 23.04,40.92 22.52,40.92
$1N2030: length 14.1
  Top Layer w0.254: RD1.2 21.59,5.56 20.59,4.56 14.83,4.56 13.65,5.74 USB1.A5
$1N2031: length 10
  Top Layer w0.254: USB1.B5 16.65,5.66 17.19,5.12 20.39,5.12 20.76,5.49 20.76,8.92 20.58,9.1
$1N2038: length 4.9
  Top Layer w0.254: RA1.1 5.74,19.42 6.25,18.91 6.25,17.9 5.93,17.58 P1.6
$1N5947: length 1.9
  Top Layer w0.508: U1.3 1.38,38.92 L1.1
$1N5953: length 2.5
  Top Layer w0.254: 5.52,35.28 4.5,35.28
  Top Layer w0.508: 4.5,35.28 3.97,35.28 U1.5
$1N6173: length 3.8
  Top Layer w0.254: UART1.5 27.47,35.86 27.74,35.59 28.38,35.59 28.63,35.84 R8.2
$1N9979: length 5.9
  Top Layer w0.203: 24.36,9.55 RL1.1 24.36,6.83 24.82,6.38 25.84,6.38 26.3,6.84 LED1.3

## Copper pours and planes (outline as drawn; the poured copper is in the pictures)
GND on Top Layer: -7.47,50.41 31.27,50.41 31.27,-1.15 -7.47,-1.15
GND on Bottom Layer: -1.37,57.39 37.11,57.39 37.11,-0.77 -1.37,-0.77

## Text on the board
Bottom Solder Mask Layer: rev paw-3
Bottom Silkscreen Layer: IMU:LSM6DSV / DEG_0 | openpawlabs.com | ブルーベリー | 」 | CheeseCake | 「 | (BB-LSM6DSV) | v2.2.1 | + | - | blueberry | DIY SlimeVR | SlimeVR「CheeseCake」
Document Layer: Y | TP4057:2K | Some pins on ESP-12F was removed due to easy wiring | AD0=L / IIC ADDR=0X68
Top Solder Mask Layer: - | 5V | 「 | CheeseCake | SlimeVR | 」 | ▲ | 400mA | blueberry
Top Silkscreen Layer: + | - | openpawlabs.com | LSM6DSV | IMU | UART | Bakery | USB | DCDC | SK's
